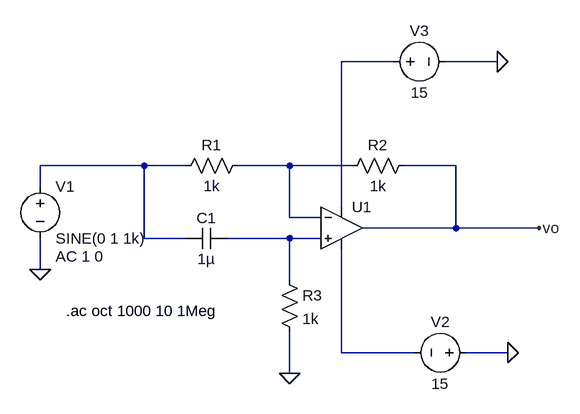
[diagram p0: schematic Ej4_a.asc]
Ej4_a.asc, the LTspice schematic file:
Version 4
SHEET 1 880 680
WIRE 464 -16 384 -16
WIRE 624 -16 544 -16
WIRE 80 144 -80 144
WIRE 144 144 80 144
WIRE 304 144 224 144
WIRE 400 144 304 144
WIRE 560 144 480 144
WIRE -80 176 -80 144
WIRE 384 208 384 -16
WIRE 304 224 304 144
WIRE 352 224 304 224
WIRE 560 240 560 144
WIRE 560 240 416 240
WIRE 688 240 560 240
WIRE 80 256 80 144
WIRE 144 256 80 256
WIRE 304 256 208 256
WIRE 352 256 304 256
WIRE -80 304 -80 256
WIRE 304 320 304 256
WIRE 384 432 384 272
WIRE 496 432 384 432
WIRE 640 432 576 432
WIRE 304 464 304 400
FLAG 304 464 0
FLAG 624 -16 0
FLAG 640 432 0
FLAG -80 304 0
FLAG 688 240 vo
SYMBOL OpAmps\\UniversalOpAmp1 384 240 R0
SYMATTR InstName U1
SYMBOL res 240 128 R90
WINDOW 0 0 56 VBottom 2
WINDOW 3 32 56 VTop 2
SYMATTR InstName R1
SYMATTR Value 1k
SYMBOL res 496 128 R90
WINDOW 0 0 56 VBottom 2
WINDOW 3 32 56 VTop 2
SYMATTR InstName R2
SYMATTR Value 1k
SYMBOL res 288 304 R0
SYMATTR InstName R3
SYMATTR Value 1k
SYMBOL cap 208 240 R90
WINDOW 0 0 32 VBottom 2
WINDOW 3 32 32 VTop 2
SYMATTR InstName C1
SYMATTR Value 1µ
SYMBOL voltage -80 160 R0
WINDOW 123 24 124 Left 2
WINDOW 39 0 0 Left 0
SYMATTR InstName V1
SYMATTR Value SINE(0 1 1k)
SYMATTR Value2 AC 1 0
SYMBOL voltage 592 432 R90
WINDOW 0 -32 56 VBottom 2
WINDOW 3 32 56 VTop 2
WINDOW 123 0 0 Left 0
WINDOW 39 0 0 Left 0
SYMATTR InstName V2
SYMATTR Value 15
SYMBOL voltage 448 -16 R270
WINDOW 0 32 56 VTop 2
WINDOW 3 -32 56 VBottom 2
WINDOW 123 0 0 Left 0
WINDOW 39 0 0 Left 0
SYMATTR InstName V3
SYMATTR Value 15
TEXT -40 368 Left 2 !.ac oct 1000 10 1Meg

The netlist it stands for:
* Ej4_a.asc
XU1 N004 N003 N001 N005 vo level1 Avol=1Meg GBW=10Meg Vos=0 En=0 Enk=0 In=0 Ink=0 Rin=500Meg  ; pins In+ In- V+ V- OUT
R1 N003 N002 1k
R2 vo N003 1k
R3 N004 0 1k
C1 N004 N002 1µ
V1 N002 0 SINE(0 1 1k) AC 1 0
V2 0 N005 15
V3 N001 0 15
.ac oct 1000 10 1Meg
.lib UniversalOpAmp1.lib
.backanno
.end